# Altium project BMS_SLAVE.PrjPcb
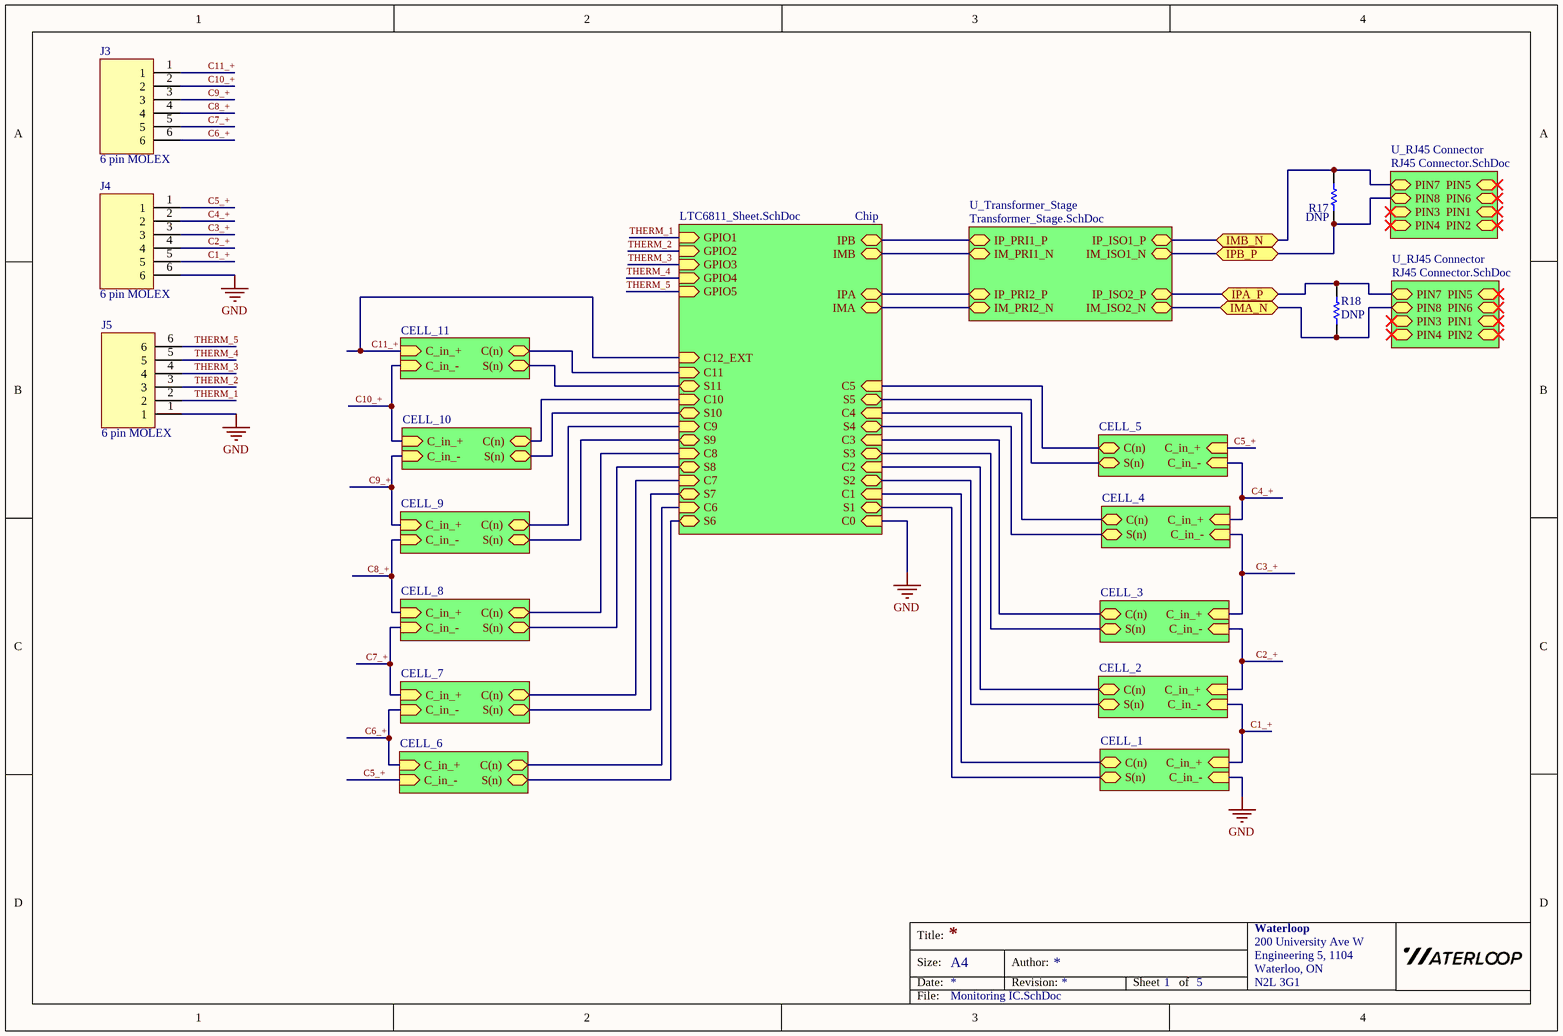
[diagram p0: Monitoring IC.SchDoc]
5 sheets, 68 parts. Net scope: hierarchical (ports join the sheet entries above them; power ports are global).
Board file: SLAVE_BOARD_r1.PcbDoc
Sheets:
  Monitoring IC.SchDoc
    Chip = LTC6811_Sheet.SchDoc
    U_RJ45 Connector = RJ45 Connector.SchDoc
    CELL_11 = Cell Balancing.SchDoc
    CELL_10 = Cell Balancing.SchDoc
    CELL_9 = Cell Balancing.SchDoc
    CELL_8 = Cell Balancing.SchDoc
    CELL_7 = Cell Balancing.SchDoc
    CELL_5 = Cell Balancing.SchDoc
    CELL_4 = Cell Balancing.SchDoc
    CELL_3 = Cell Balancing.SchDoc
    CELL_2 = Cell Balancing.SchDoc
    CELL_1 = Cell Balancing.SchDoc
    CELL_6 = Cell Balancing.SchDoc
    U_RJ45 Connector = RJ45 Connector.SchDoc
    U_Transformer_Stage = Transformer_Stage.SchDoc

## Sheet Monitoring IC.SchDoc
size A4; Organization: Waterloop; Address1: 200 University Ave W; Address2: Engineering 5, 1104; Address3: Waterloo, ON; Address4: N2L 3G1; SheetNumber: 1; SheetTotal: 5

### Parts
J3  6 pin MOLEX  [1726480106]
J4  6 pin MOLEX  [1726480106]
J5  6 pin MOLEX  [1726480106]
R17  value DNP  [0805 - Resistor]  (hidden comment: Resistor)
R18  value DNP  [0805 - Resistor]  (hidden comment: Resistor)

### Sub-sheets
CELL_1 = Cell Balancing.SchDoc: S(n) (bidir), C(n) (bidir), C_in_+ (in), C_in_- (in)
CELL_2 = Cell Balancing.SchDoc: S(n) (bidir), C(n) (bidir), C_in_+ (in), C_in_- (in)
CELL_3 = Cell Balancing.SchDoc: S(n) (bidir), C(n) (bidir), C_in_+ (in), C_in_- (in)
CELL_4 = Cell Balancing.SchDoc: S(n) (bidir), C(n) (bidir), C_in_+ (in), C_in_- (in)
CELL_5 = Cell Balancing.SchDoc: S(n) (bidir), C(n) (bidir), C_in_+ (in), C_in_- (in)
CELL_6 = Cell Balancing.SchDoc: S(n) (bidir), C(n) (bidir), C_in_+ (in), C_in_- (in)
CELL_7 = Cell Balancing.SchDoc: S(n) (bidir), C(n) (bidir), C_in_+ (in), C_in_- (in)
CELL_8 = Cell Balancing.SchDoc: S(n) (bidir), C(n) (bidir), C_in_+ (in), C_in_- (in)
CELL_9 = Cell Balancing.SchDoc: S(n) (bidir), C(n) (bidir), C_in_+ (in), C_in_- (in)
CELL_10 = Cell Balancing.SchDoc: S(n) (bidir), C(n) (bidir), C_in_+ (in), C_in_- (in)
CELL_11 = Cell Balancing.SchDoc: S(n) (bidir), C(n) (bidir), C_in_+ (in), C_in_- (in)
Chip = LTC6811_Sheet.SchDoc: IPB (bidir), IMB (bidir), IPA (bidir), IMA (bidir), C0 (in), C1 (in), C2 (in), C3 (in), C4 (in), C5 (in), C6 (in), C7 (in), C8 (in), C9 (in), C10 (in), C11 (in), S1 (bidir), S2 (bidir), S3 (bidir), S4 (bidir), S5 (bidir), S6 (bidir), S7 (bidir), S8 (bidir), S9 (bidir), S10 (bidir), S11 (bidir), GPIO1 (in), GPIO2 (in), GPIO3 (in), GPIO4 (in), GPIO5 (in), C12_EXT (in)
U_RJ45 Connector = RJ45 Connector.SchDoc: PIN1 (bidir), PIN2 (bidir), PIN3 (bidir), PIN4 (bidir), PIN5 (bidir), PIN6 (bidir), PIN7 (bidir), PIN8 (bidir)
U_RJ45 Connector = RJ45 Connector.SchDoc: PIN1 (bidir), PIN2 (bidir), PIN3 (bidir), PIN4 (bidir), PIN5 (bidir), PIN6 (bidir), PIN7 (bidir), PIN8 (bidir)
U_Transformer_Stage = Transformer_Stage.SchDoc: IP_PRI1_P (bidir), IM_PRI1_N (bidir), IP_ISO1_P (bidir), IM_ISO1_N (bidir), IP_PRI2_P (bidir), IM_PRI2_N (bidir), IP_ISO2_P (bidir), IM_ISO2_N (bidir)

### Ports
IMA_N (bidir), IMB_N (bidir), IPA_P (bidir), IPB_P (bidir)

### Nets
GND: J4.6 J5.1 ; sheet Chip/C0, sheet CELL_1/C_in_-  [project net C0]
C1: sheet Chip/C1, sheet CELL_1/C(n)
C1_+: J4.5 ; sheet CELL_2/C_in_-, sheet CELL_1/C_in_+
C2: sheet Chip/C2, sheet CELL_2/C(n)
C2_+: J4.4 ; sheet CELL_3/C_in_-, sheet CELL_2/C_in_+
C3: sheet Chip/C3, sheet CELL_3/C(n)
C3_+: J4.3 ; sheet CELL_4/C_in_-, sheet CELL_3/C_in_+
C4: sheet Chip/C4, sheet CELL_4/C(n)
C4_+: J4.2 ; sheet CELL_5/C_in_-, sheet CELL_4/C_in_+
C5: sheet Chip/C5, sheet CELL_5/C(n)
C5_+: J4.1 ; sheet CELL_5/C_in_+, sheet CELL_6/C_in_-
C6: sheet Chip/C6, sheet CELL_6/C(n)
C6_+: J3.6 ; sheet CELL_7/C_in_-, sheet CELL_6/C_in_+
C7: sheet Chip/C7, sheet CELL_7/C(n)
C7_+: J3.5 ; sheet CELL_8/C_in_-, sheet CELL_7/C_in_+
C8: sheet Chip/C8, sheet CELL_8/C(n)
C8_+: J3.4 ; sheet CELL_9/C_in_-, sheet CELL_8/C_in_+
C9: sheet Chip/C9, sheet CELL_9/C(n)
C9_+: J3.3 ; sheet CELL_10/C_in_-, sheet CELL_9/C_in_+
C10: sheet Chip/C10, sheet CELL_10/C(n)
C10_+: J3.2 ; sheet CELL_11/C_in_-, sheet CELL_10/C_in_+
C11: sheet Chip/C11, sheet CELL_11/C(n)
C11_+: J3.1 ; sheet Chip/C12_EXT, sheet CELL_11/C_in_+
ISO1_N: R17.1 ; port IPB_P, sheet U_RJ45 Connector/PIN8, sheet U_Transformer_Stage/IM_ISO1_N
ISO1_P: R17.2 ; port IMB_N, sheet U_RJ45 Connector/PIN7, sheet U_Transformer_Stage/IP_ISO1_P
ISO2_N: R18.2 ; port IMA_N, sheet U_RJ45 Connector/PIN8, sheet U_Transformer_Stage/IM_ISO2_N
ISO2_P: R18.1 ; port IPA_P, sheet U_RJ45 Connector/PIN7, sheet U_Transformer_Stage/IP_ISO2_P
PRI1_N: sheet Chip/IMB, sheet U_Transformer_Stage/IM_PRI1_N
PRI1_P: sheet Chip/IPB, sheet U_Transformer_Stage/IP_PRI1_P
PRI2_N: sheet Chip/IMA, sheet U_Transformer_Stage/IM_PRI2_N
PRI2_P: sheet Chip/IPA, sheet U_Transformer_Stage/IP_PRI2_P
S1: sheet Chip/S1, sheet CELL_1/S(n)
S2: sheet Chip/S2, sheet CELL_2/S(n)
S3: sheet Chip/S3, sheet CELL_3/S(n)
S4: sheet Chip/S4, sheet CELL_4/S(n)
S5: sheet Chip/S5, sheet CELL_5/S(n)
S6: sheet Chip/S6, sheet CELL_6/S(n)
S7: sheet Chip/S7, sheet CELL_7/S(n)
S8: sheet Chip/S8, sheet CELL_8/S(n)
S9: sheet Chip/S9, sheet CELL_9/S(n)
S10: sheet Chip/S10, sheet CELL_10/S(n)
S11: sheet Chip/S11, sheet CELL_11/S(n)
THERM_1: J5.2 ; sheet Chip/GPIO1  [project net GPIO1]
THERM_2: J5.3 ; sheet Chip/GPIO2  [project net GPIO2]
THERM_3: J5.4 ; sheet Chip/GPIO3  [project net GPIO3]
THERM_4: J5.5 ; sheet Chip/GPIO4  [project net GPIO4]
THERM_5: J5.6 ; sheet Chip/GPIO5  [project net GPIO5]

### Notes on the sheet
- Title:
- Size:
- Date:
- A4
- Author:
- Revision:
- Sheet
- of
- File:

### Library data of the parts
J3-J5 = MOLEX1726480106: 1x6 MOLEX MiniFit Jr. Connector
R17 R18 = Resistor: Rating: *; Manufacturer Part Number: *; Manufacturer: *; Supplier Part Number: *; Supplier: *

## Sheet LTC6811_Sheet.SchDoc
size A4; Organization: Waterloop; Address1: 200 University Ave W; Address2: Engineering 5, 1104; Address3: Waterloo, ON; Address4: N2L 3G1; SheetNumber: 3; SheetTotal: 5
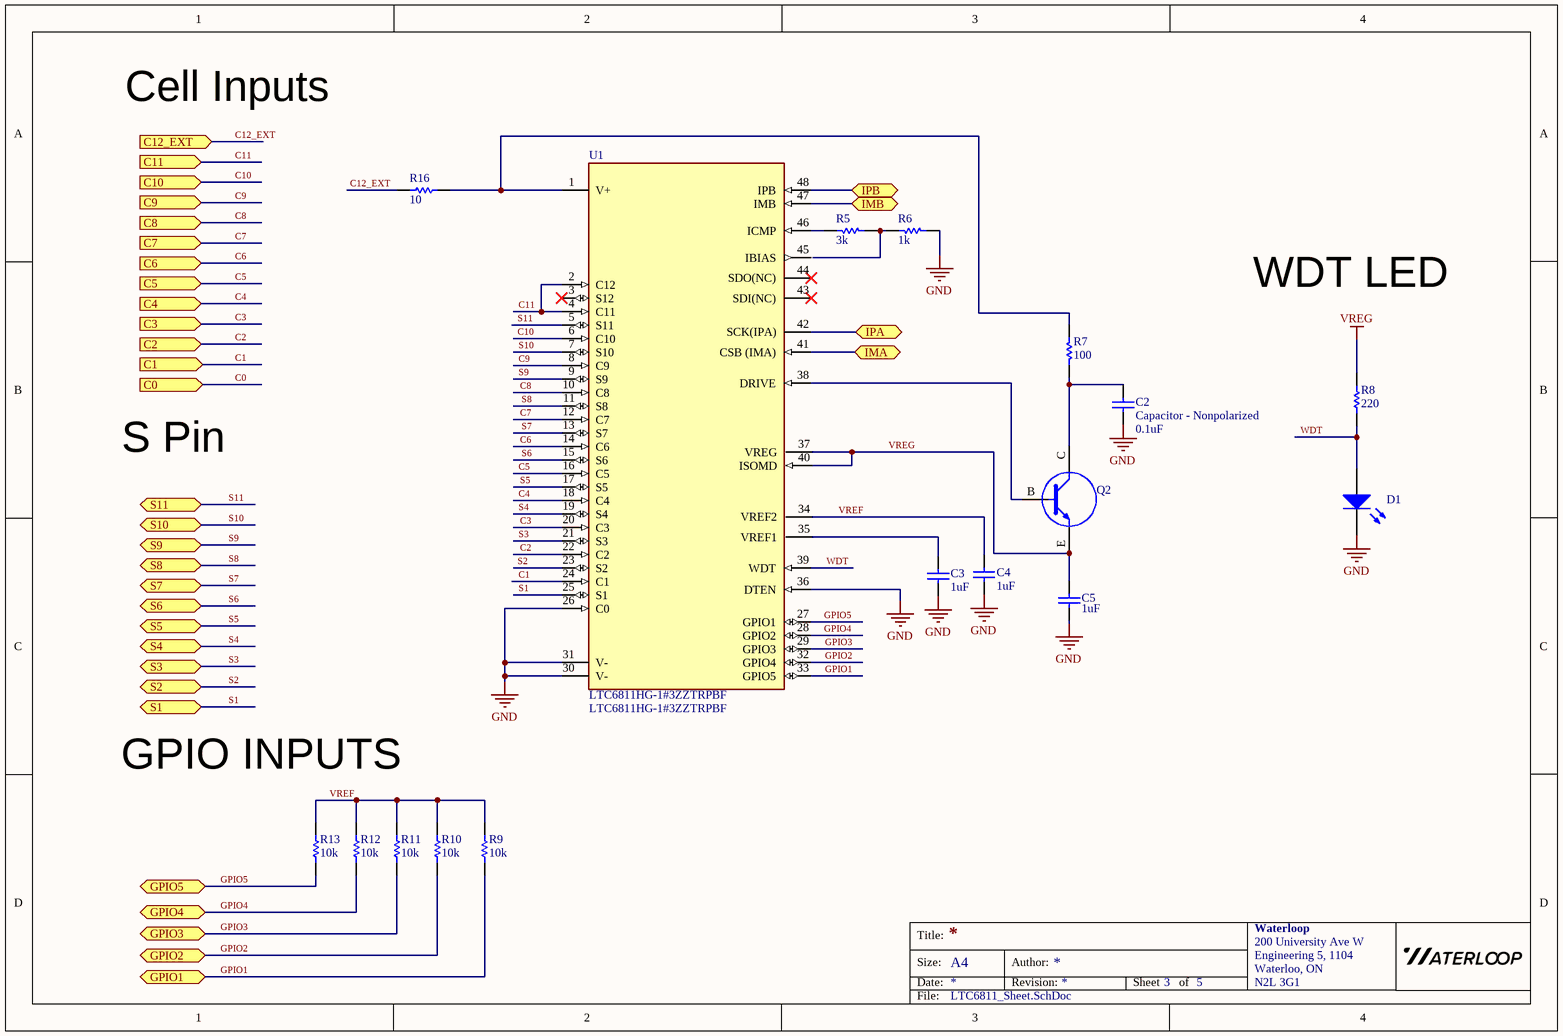
[diagram p1: LTC6811_Sheet.SchDoc]

### Parts
C2  Capacitor - Nonpolarized  value 0.1uF  [0603 - Capacitor]
C3  value 1uF  [0603 - Capacitor]  (hidden comment: Capacitor - Nonpolarized)
C4  value 1uF  [0603 - Capacitor]  (hidden comment: Capacitor - Nonpolarized)
C5  value 1uF  [0603 - Capacitor]  (hidden comment: Capacitor - Nonpolarized)
D1  LED  [0805 - DIODE]  (value not drawn)
Q2  TRANS NPN 160V 0.6A POWERDI5  [DXT5551P5]  (value not drawn)
R5  value 3k  [0603 - Resistor]  (hidden comment: Resistor)
R6  value 1k  [0603 - Resistor]  (hidden comment: Resistor)
R7  value 100  [0603 - Resistor]  (hidden comment: Resistor)
R8  value 220  [0603 - Resistor]  (hidden comment: Resistor)
R9  value 10k  [0603 - Resistor]  (hidden comment: Resistor)
R10  value 10k  [0603 - Resistor]  (hidden comment: Resistor)
R11  value 10k  [0603 - Resistor]  (hidden comment: Resistor)
R12  value 10k  [0603 - Resistor]  (hidden comment: Resistor)
R13  value 10k  [0603 - Resistor]  (hidden comment: Resistor)
R16  value 10  [0603 - Resistor]  (hidden comment: Resistor)
U1  LTC6811HG-1#3ZZTRPBF  [LTC6811-1]

### Ports
C0 (in, see Monitoring IC[3C]), C1 (in, see Monitoring IC[3B]), C2 (in, see Monitoring IC[3B]), C3 (in, see Monitoring IC[3B]), C4 (in, see Monitoring IC[3B]), C5 (in, see Monitoring IC[3B]), C6 (in, see Monitoring IC[2B]), C7 (in, see Monitoring IC[2B]), C8 (in, see Monitoring IC[2B]), C9 (in, see Monitoring IC[2B]), C10 (in, see Monitoring IC[2B]), C11 (in, see Monitoring IC[2B]), C12_EXT (in, see Monitoring IC[2B]), GPIO1 (bidir, see Monitoring IC[2A]), GPIO2 (bidir, see Monitoring IC[2A]), GPIO3 (bidir, see Monitoring IC[2B]), GPIO4 (bidir, see Monitoring IC[2B]), GPIO5 (bidir, see Monitoring IC[2B]), IMA (bidir, see Monitoring IC[3B]), IMB (bidir, see Monitoring IC[3A]), IPA (bidir, see Monitoring IC[3B]), IPB (bidir, see Monitoring IC[3A]), S1 (bidir, see Monitoring IC[3B]), S2 (bidir, see Monitoring IC[3B]), S3 (bidir, see Monitoring IC[3B]), S4 (bidir, see Monitoring IC[3B]), S5 (bidir, see Monitoring IC[3B]), S6 (bidir, see Monitoring IC[2C]), S7 (bidir, see Monitoring IC[2B]), S8 (bidir, see Monitoring IC[2B]), S9 (bidir, see Monitoring IC[2B]), S10 (bidir, see Monitoring IC[2B]), S11 (bidir, see Monitoring IC[2B])

### Nets
C0: C2.1 C3.1 C4.1 C5.1 D1.2(K) R6.1 U1.26(C0) U1.30(V-) U1.31(V-) U1.36(DTEN) ; port C0  [also labelled GND]
VREG: C5.2 Q2.E R8.2 U1.37(VREG) U1.40(ISOMD)
C1: U1.24(C1) ; port C1
C2: U1.22(C2) ; port C2
C3: U1.20(C3) ; port C3
C4: U1.18(C4) ; port C4
C5: U1.16(C5) ; port C5
C6: U1.14(C6) ; port C6
C7: U1.12(C7) ; port C7
C8: U1.10(C8) ; port C8
C9: U1.8(C9) ; port C9
C10: U1.6(C10) ; port C10
C11: U1.2(C12) U1.4(C11) ; port C11
C12_EXT: R16.1 ; port C12_EXT  [project net C11_+]
GPIO1: R9.1 U1.33(GPIO5) ; port GPIO1
GPIO2: R10.1 U1.32(GPIO4) ; port GPIO2
GPIO3: R11.1 U1.29(GPIO3) ; port GPIO3
GPIO4: R12.1 U1.28(GPIO2) ; port GPIO4
GPIO5: R13.1 U1.27(GPIO1) ; port GPIO5
PRI1_N: U1.47(IMB) ; port IMB
PRI1_P: U1.48(IPB) ; port IPB
PRI2_N: U1.41(CSB_(IMA)) ; port IMA
PRI2_P: U1.42(SCK(IPA)) ; port IPA
S1: U1.25(S1) ; port S1
S2: U1.23(S2) ; port S2
S3: U1.21(S3) ; port S3
S4: U1.19(S4) ; port S4
S5: U1.17(S5) ; port S5
S6: U1.15(S6) ; port S6
S7: U1.13(S7) ; port S7
S8: U1.11(S8) ; port S8
S9: U1.9(S9) ; port S9
S10: U1.7(S10) ; port S10
S11: U1.5(S11) ; port S11
VREF: C4.2 R9.2 R10.2 R11.2 R12.2 R13.2 U1.34(VREF2)
WDT: D1.1(A) R8.1 U1.39(WDT)
NetC2_2: C2.2 Q2.C R7.2
NetC3_2: C3.2 U1.35(VREF1)
NetQ2_B: Q2.B U1.38(DRIVE)
NetR5_1: R5.1 R6.2
NetR5_2: R5.2 U1.46(ICMP)
NetR7_1: R7.1 R16.2 U1.1(V+)

Not connected (* = marked no-connect by the designer): U1 3(S12)* 43(SDI(NC))* 44(SDO(NC))* 45(IBIAS)

### Notes on the sheet
- Cell Inputs
- WDT LED
- S Pin
- GPIO INPUTS
- Title:
- Size:
- Date:
- A4
- Author:
- Revision:
- Sheet
- of
- File:

### Library data of the parts
C2-C5 = Capacitor - Nonpolarized: Nonpolarized Capacitor; Supplier Part Number: *; Supplier: *; Manufacturer: *; Rating: *; Manufacturer Part Number: *
D1 = LED: Light Emitting Diode; Value: *; Manufacturer Part Number: *; Manufacturer: *; Supplier Part Number: *; Rating: *; Supplier: *
Q2 = DXT5551P5-13: Bipolar (BJT) Transistor NPN 160 V 600 mA 130MHz 2.25 W Surface Mount PowerDI™ 5
U1 = LTC6811HG-1#3ZZTRPBF: Multicell Battery Balancer 5.7V Automotive 48-Pin SSOP T/R; Manufacturer: Analog Devices / Linear Technology; Analog IC - Other Type: POWER SUPPLY MANAGEMENT CIRCUIT; Supplier 1: Mouser; RoHS: Yes; Category: Battery Management; Pricing 1: 1=21.45000, 10=19.72000, 25=18.91000, 50=18.91000, 100=18.91000, 111=16.65000, 1000=16.65000, 10000=16.65000 (USD); REACH SVHC: Yes; RoHS Compliant: Yes; ComponentLink1URL: https://www.analog.com/media/en/technical-documentation/data-sheets/LTC6811-1-6811-2.pdf; ComponentLink1Description: https://datasheet.ciiva.com:443/pdfs/VipMasterIC/IC/LITC/LITC-S-A0003389121/LITC-S-A0003389121-1.pdf?src-supplier=IHS+Markit; Manufacturer Part Number: LTC6811HG-1#3ZZTRPBF; Supplier 2: Mouser; Supplier Part Number 2: 584-6811HG-1#3ZZTRPB; Pricing 2: 1=22.70000, 10=20.93000, 50=20.00000, 100=17.88000, 1000=16.64000, 10000=16.64000 (USD)
R5-R13 R16 = Resistor: Rating: *; Manufacturer Part Number: *; Manufacturer: *; Supplier Part Number: *; Supplier: *

## Sheet RJ45 Connector.SchDoc
size A4; Organization: Waterloop; Address1: 200 University Ave W; Address2: Engineering 5, 1104; Address3: Waterloo, ON; Address4: N2L 3G1; SheetNumber: 5; SheetTotal: 5
Used 2 times, as channels U_RJ45 Connector, U_RJ45 Connector. Parts and nets are listed once, with the designators drawn on the sheet.
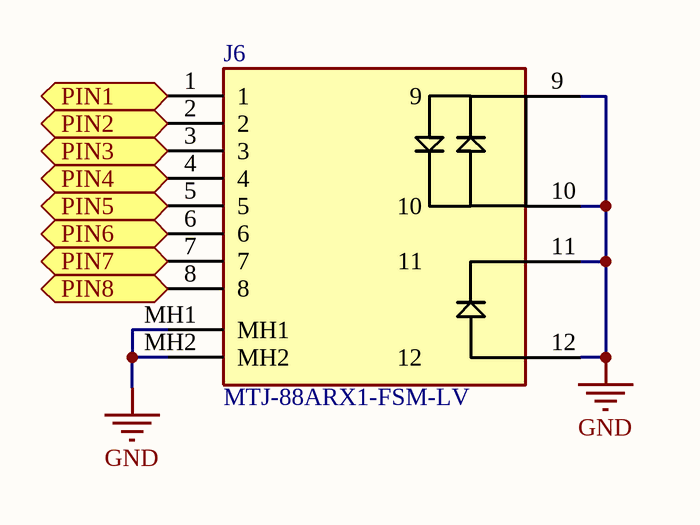
[diagram p2: RJ45 Connector.SchDoc]

### Parts
J6  MTJ-88ARX1-FSM-LV  [MTJ-88ARX1-FSM-LV]

### Ports
PIN1 (bidir, see Monitoring IC[4A]), PIN2 (bidir, see Monitoring IC[4A]), PIN3 (bidir, see Monitoring IC[4A]), PIN4 (bidir, see Monitoring IC[4A]), PIN5 (bidir, see Monitoring IC[4A]), PIN6 (bidir, see Monitoring IC[4A]), PIN7 (bidir, see Monitoring IC[4A]), PIN8 (bidir, see Monitoring IC[4A])

### Nets
GND: J6.9 J6.10 J6.11 J6.12 J6.MH1 J6.MH2
PIN1: J6.1 ; port PIN1
PIN2: J6.2 ; port PIN2
PIN3: J6.3 ; port PIN3
PIN4: J6.4 ; port PIN4
PIN5: J6.5 ; port PIN5
PIN6: J6.6 ; port PIN6
PIN7: J6.7 ; port PIN7
PIN8: J6.8 ; port PIN8

### Channels
U_RJ45 Connector: designators end in _U_RJ45_Connector2; ports PIN1=NetJ6_U_RJ45_Connector2_1 PIN2=NetJ6_U_RJ45_Connector2_2 PIN3=NetJ6_U_RJ45_Connector2_3 PIN4=NetJ6_U_RJ45_Connector2_4 PIN5=NetJ6_U_RJ45_Connector2_5 PIN6=NetJ6_U_RJ45_Connector2_6 PIN7=ISO2_P PIN8=ISO2_N
U_RJ45 Connector: designators end in _U_RJ45_Connector1; ports PIN1=NetJ6_U_RJ45_Connector1_1 PIN2=NetJ6_U_RJ45_Connector1_2 PIN3=NetJ6_U_RJ45_Connector1_3 PIN4=NetJ6_U_RJ45_Connector1_4 PIN5=NetJ6_U_RJ45_Connector1_5 PIN6=NetJ6_U_RJ45_Connector1_6 PIN7=ISO1_P PIN8=ISO1_N

### Notes on the sheet
- Title:
- Size:
- Date:
- A4
- Author:
- Revision:
- Sheet
- of
- File:

### Library data of the parts
J6 = MTJ-88ARX1-FSM-LV: RJ45 Connector

## Sheet Cell Balancing.SchDoc
size A4; Organization: Waterloop; Address1: 200 University Ave W; Address2: Engineering 5, 1104; Address3: Waterloo, ON; Address4: N2L 3G1; SheetNumber: 2; SheetTotal: 5
Used 11 times, as channels CELL_11, CELL_10, CELL_9, CELL_8, CELL_7, CELL_5, CELL_4, CELL_3, CELL_2, CELL_1, CELL_6. Parts and nets are listed once, with the designators drawn on the sheet.
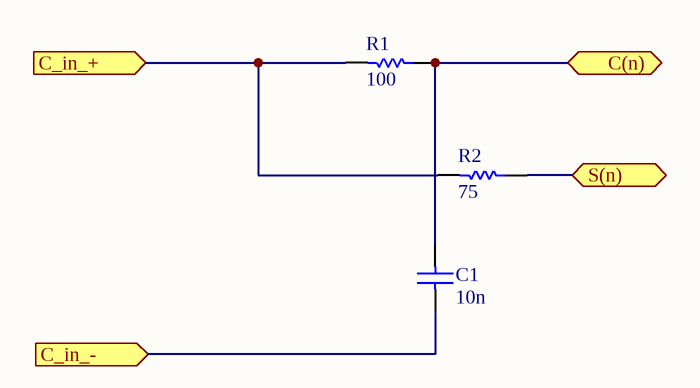
[diagram p3: Cell Balancing.SchDoc]

### Parts
C1  value 10n  [0603 - Capacitor]  (hidden comment: Capacitor - Nonpolarized)
R1  value 100  [0805 - Resistor]  (hidden comment: Resistor)
R2  value 75  [0805 - Resistor]  (hidden comment: Resistor)

### Ports
C(n) (bidir, see Monitoring IC[3C]), C_in_+ (in, see Monitoring IC[4C]), C_in_- (in, see Monitoring IC[4D]), S(n) (bidir, see Monitoring IC[3D])

### Nets
C(n): C1.2 R1.1 ; port C(n)
C_in_+: R1.2 R2.2 ; port C_in_+
C_in_-: C1.1 ; port C_in_-
S(n): R2.1 ; port S(n)

### Channels
CELL_11: designators end in _CELL_11; ports C(n)=C11 C_in_+=C11_+ C_in_-=C10_+ S(n)=S11
CELL_10: designators end in _CELL_10; ports C(n)=C10 C_in_+=C10_+ C_in_-=C9_+ S(n)=S10
CELL_9: designators end in _CELL_9; ports C(n)=C9 C_in_+=C9_+ C_in_-=C8_+ S(n)=S9
CELL_8: designators end in _CELL_8; ports C(n)=C8 C_in_+=C8_+ C_in_-=C7_+ S(n)=S8
CELL_7: designators end in _CELL_7; ports C(n)=C7 C_in_+=C7_+ C_in_-=C6_+ S(n)=S7
CELL_5: designators end in _CELL_5; ports C(n)=C5 C_in_+=C5_+ C_in_-=C4_+ S(n)=S5
CELL_4: designators end in _CELL_4; ports C(n)=C4 C_in_+=C4_+ C_in_-=C3_+ S(n)=S4
CELL_3: designators end in _CELL_3; ports C(n)=C3 C_in_+=C3_+ C_in_-=C2_+ S(n)=S3
CELL_2: designators end in _CELL_2; ports C(n)=C2 C_in_+=C2_+ C_in_-=C1_+ S(n)=S2
CELL_1: designators end in _CELL_1; ports C(n)=C1 C_in_+=C1_+ C_in_-=C0 S(n)=S1
CELL_6: designators end in _CELL_6; ports C(n)=C6 C_in_+=C6_+ C_in_-=C5_+ S(n)=S6

### Notes on the sheet
- Title:
- Size:
- Date:
- A4
- Author:
- Revision:
- Sheet
- of
- File:

### Library data of the parts
C1 = Capacitor - Nonpolarized: Nonpolarized Capacitor; Supplier: *; Supplier Part Number: *; Rating: *; Manufacturer: *; Manufacturer Part Number: *
R1 R2 = Resistor: Rating: *; Manufacturer Part Number: *; Manufacturer: *; Supplier Part Number: *; Supplier: *

## Sheet Transformer_Stage.SchDoc
size A4; Organization: Waterloop; Address1: 200 University Ave W; Address2: Engineering 5, 1104; Address3: Waterloo, ON; Address4: N2L 3G1; SheetNumber: 4; SheetTotal: 5
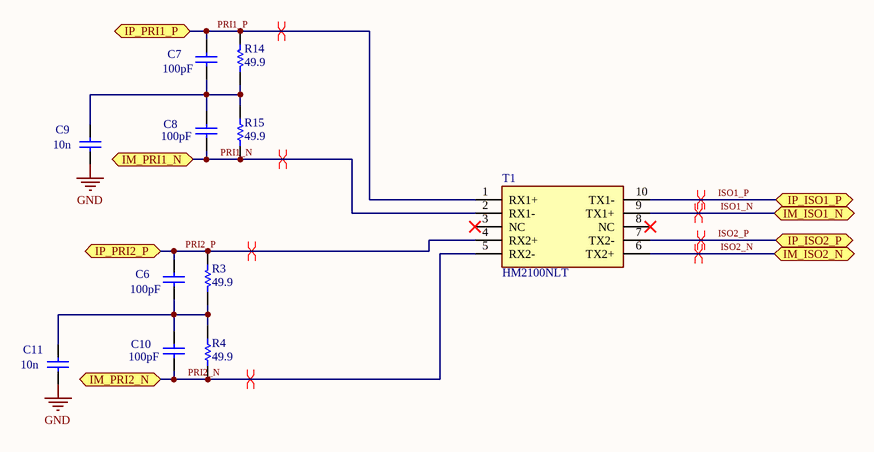
[diagram p4: Transformer_Stage.SchDoc]

### Parts
C6  value 100pF  [0603 - Capacitor]  (hidden comment: Capacitor - Nonpolarized)
C7  value 100pF  [0603 - Capacitor]  (hidden comment: Capacitor - Nonpolarized)
C8  value 100pF  [0603 - Capacitor]  (hidden comment: Capacitor - Nonpolarized)
C9  value 10n  [0603 - Capacitor]  (hidden comment: Capacitor - Nonpolarized)
C10  value 100pF  [0603 - Capacitor]  (hidden comment: Capacitor - Nonpolarized)
C11  value 10n  [0603 - Capacitor]  (hidden comment: Capacitor - Nonpolarized)
R3  value 49.9  [0603 - Resistor]  (hidden comment: Resistor)
R4  value 49.9  [0603 - Resistor]  (hidden comment: Resistor)
R14  value 49.9  [0603 - Resistor]  (hidden comment: Resistor)
R15  value 49.9  [0603 - Resistor]  (hidden comment: Resistor)
T1  HM2100NLT  [HM2100NLT]

### Ports
IM_ISO1_N (bidir, see Monitoring IC[4A]), IM_ISO2_N (bidir, see Monitoring IC[4B]), IM_PRI1_N (bidir, see Monitoring IC[3A]), IM_PRI2_N (bidir, see Monitoring IC[3B]), IP_ISO1_P (bidir, see Monitoring IC[4A]), IP_ISO2_P (bidir, see Monitoring IC[4B]), IP_PRI1_P (bidir, see Monitoring IC[3A]), IP_PRI2_P (bidir, see Monitoring IC[3B])

### Nets
GND: C9.2 C11.2  [project net C0]
ISO1_N: T1.9(TX1+) ; port IM_ISO1_N
ISO1_P: T1.10(TX1-) ; port IP_ISO1_P
ISO2_N: T1.6(TX2+) ; port IM_ISO2_N
ISO2_P: T1.7(TX2-) ; port IP_ISO2_P
PRI1_N: C8.2 R15.1 T1.2(RX1-) ; port IM_PRI1_N
PRI1_P: C7.1 R14.1 T1.1(RX1+) ; port IP_PRI1_P
PRI2_N: C10.2 R4.1 T1.5(RX2-) ; port IM_PRI2_N
PRI2_P: C6.1 R3.1 T1.4(RX2+) ; port IP_PRI2_P
NetC6_2: C6.2 C10.1 C11.1 R3.2 R4.2
NetC7_2: C7.2 C8.1 C9.1 R14.2 R15.2

Not connected (* = marked no-connect by the designer): T1 3(NC)* 8(NC)*

### Layout directives
differential pair: ISO1_N, ISO1_P, ISO2_N, ISO2_P, PRI1_N, PRI1_P, PRI2_N, PRI2_P

### Notes on the sheet
- Title:
- Size:
- Date:
- A4
- Author:
- Revision:
- Sheet
- of
- File:

### Library data of the parts
C6-C11 = Capacitor - Nonpolarized: Nonpolarized Capacitor; Supplier Part Number: *; Supplier: *; Manufacturer: *; Rating: *; Manufacturer Part Number: *
T1 = HM2100NLT: Pulse Transformer 1:1 Surface Mount 150µH, 450µH; Manufacturer: Pulse Electronics; Supplier Part Number: 1840-1032-1-ND; Supplier: Digikey; Manufacturer Part Number: HM2100NLT; ComponentLink1Description: Datasheet; ComponentLink1URL: https://productfinder.pulseeng.com/doc_type/WEB301/doc_num/HM2100NL/doc_part/HM2100NL.pdf
R3 R4 R14 R15 = Resistor: Rating: *; Manufacturer Part Number: *; Manufacturer: *; Supplier Part Number: *; Supplier: *

## Nets that join several sheets
C0: Monitoring IC (J4.6 J5.1), LTC6811_Sheet (10 pins), U_RJ45 Connector (6 pins), CELL_1 (C1_CELL_1.1), U_RJ45 Connector (6 pins), Transformer_Stage (C9.2 C11.2)
C1: LTC6811_Sheet (U1.24), CELL_1 (C1_CELL_1.2 R1_CELL_1.1)
C1_+: Monitoring IC (J4.5), CELL_2 (C1_CELL_2.1), CELL_1 (R1_CELL_1.2 R2_CELL_1.2)
C2: LTC6811_Sheet (U1.22), CELL_2 (C1_CELL_2.2 R1_CELL_2.1)
C2_+: Monitoring IC (J4.4), CELL_3 (C1_CELL_3.1), CELL_2 (R1_CELL_2.2 R2_CELL_2.2)
C3: LTC6811_Sheet (U1.20), CELL_3 (C1_CELL_3.2 R1_CELL_3.1)
C3_+: Monitoring IC (J4.3), CELL_4 (C1_CELL_4.1), CELL_3 (R1_CELL_3.2 R2_CELL_3.2)
C4: LTC6811_Sheet (U1.18), CELL_4 (C1_CELL_4.2 R1_CELL_4.1)
C4_+: Monitoring IC (J4.2), CELL_5 (C1_CELL_5.1), CELL_4 (R1_CELL_4.2 R2_CELL_4.2)
C5: LTC6811_Sheet (U1.16), CELL_5 (C1_CELL_5.2 R1_CELL_5.1)
C5_+: Monitoring IC (J4.1), CELL_5 (R1_CELL_5.2 R2_CELL_5.2), CELL_6 (C1_CELL_6.1)
C6: LTC6811_Sheet (U1.14), CELL_6 (C1_CELL_6.2 R1_CELL_6.1)
C6_+: Monitoring IC (J3.6), CELL_7 (C1_CELL_7.1), CELL_6 (R1_CELL_6.2 R2_CELL_6.2)
C7: LTC6811_Sheet (U1.12), CELL_7 (C1_CELL_7.2 R1_CELL_7.1)
C7_+: Monitoring IC (J3.5), CELL_8 (C1_CELL_8.1), CELL_7 (R1_CELL_7.2 R2_CELL_7.2)
C8: LTC6811_Sheet (U1.10), CELL_8 (C1_CELL_8.2 R1_CELL_8.1)
C8_+: Monitoring IC (J3.4), CELL_9 (C1_CELL_9.1), CELL_8 (R1_CELL_8.2 R2_CELL_8.2)
C9: LTC6811_Sheet (U1.8), CELL_9 (C1_CELL_9.2 R1_CELL_9.1)
C9_+: Monitoring IC (J3.3), CELL_10 (C1_CELL_10.1), CELL_9 (R1_CELL_9.2 R2_CELL_9.2)
C10: LTC6811_Sheet (U1.6), CELL_10 (C1_CELL_10.2 R1_CELL_10.1)
C10_+: Monitoring IC (J3.2), CELL_11 (C1_CELL_11.1), CELL_10 (R1_CELL_10.2 R2_CELL_10.2)
C11: LTC6811_Sheet (U1.2 U1.4), CELL_11 (C1_CELL_11.2 R1_CELL_11.1)
C11_+: Monitoring IC (J3.1), LTC6811_Sheet (R16.1), CELL_11 (R1_CELL_11.2 R2_CELL_11.2)
GPIO1: Monitoring IC (J5.2), LTC6811_Sheet (R9.1 U1.33)
GPIO2: Monitoring IC (J5.3), LTC6811_Sheet (R10.1 U1.32)
GPIO3: Monitoring IC (J5.4), LTC6811_Sheet (R11.1 U1.29)
GPIO4: Monitoring IC (J5.5), LTC6811_Sheet (R12.1 U1.28)
GPIO5: Monitoring IC (J5.6), LTC6811_Sheet (R13.1 U1.27)
ISO1_N: Monitoring IC (R17.1), U_RJ45 Connector (J6_U_RJ45_Connector1.8), Transformer_Stage (T1.9)
ISO1_P: Monitoring IC (R17.2), U_RJ45 Connector (J6_U_RJ45_Connector1.7), Transformer_Stage (T1.10)
ISO2_N: Monitoring IC (R18.2), U_RJ45 Connector (J6_U_RJ45_Connector2.8), Transformer_Stage (T1.6)
ISO2_P: Monitoring IC (R18.1), U_RJ45 Connector (J6_U_RJ45_Connector2.7), Transformer_Stage (T1.7)
PRI1_N: LTC6811_Sheet (U1.47), Transformer_Stage (C8.2 R15.1 T1.2)
PRI1_P: LTC6811_Sheet (U1.48), Transformer_Stage (C7.1 R14.1 T1.1)
PRI2_N: LTC6811_Sheet (U1.41), Transformer_Stage (C10.2 R4.1 T1.5)
PRI2_P: LTC6811_Sheet (U1.42), Transformer_Stage (C6.1 R3.1 T1.4)
S1: LTC6811_Sheet (U1.25), CELL_1 (R2_CELL_1.1)
S2: LTC6811_Sheet (U1.23), CELL_2 (R2_CELL_2.1)
S3: LTC6811_Sheet (U1.21), CELL_3 (R2_CELL_3.1)
S4: LTC6811_Sheet (U1.19), CELL_4 (R2_CELL_4.1)
S5: LTC6811_Sheet (U1.17), CELL_5 (R2_CELL_5.1)
S6: LTC6811_Sheet (U1.15), CELL_6 (R2_CELL_6.1)
S7: LTC6811_Sheet (U1.13), CELL_7 (R2_CELL_7.1)
S8: LTC6811_Sheet (U1.11), CELL_8 (R2_CELL_8.1)
S9: LTC6811_Sheet (U1.9), CELL_9 (R2_CELL_9.1)
S10: LTC6811_Sheet (U1.7), CELL_10 (R2_CELL_10.1)
S11: LTC6811_Sheet (U1.5), CELL_11 (R2_CELL_11.1)

## Assembly variants
START_CHAIN: not fitted J2 R17
END CHAIN: not fitted J6
TYPICAL_BOARD: not fitted J6 R17